# Altium schematic sheet Power.SchDoc
size B; SheetNumber: 3; SheetTotal: 12; SPICEModelCacheUEHXGVAP: <root> / <DocumentId>UEHXGVAP</DocumentId> / </root>
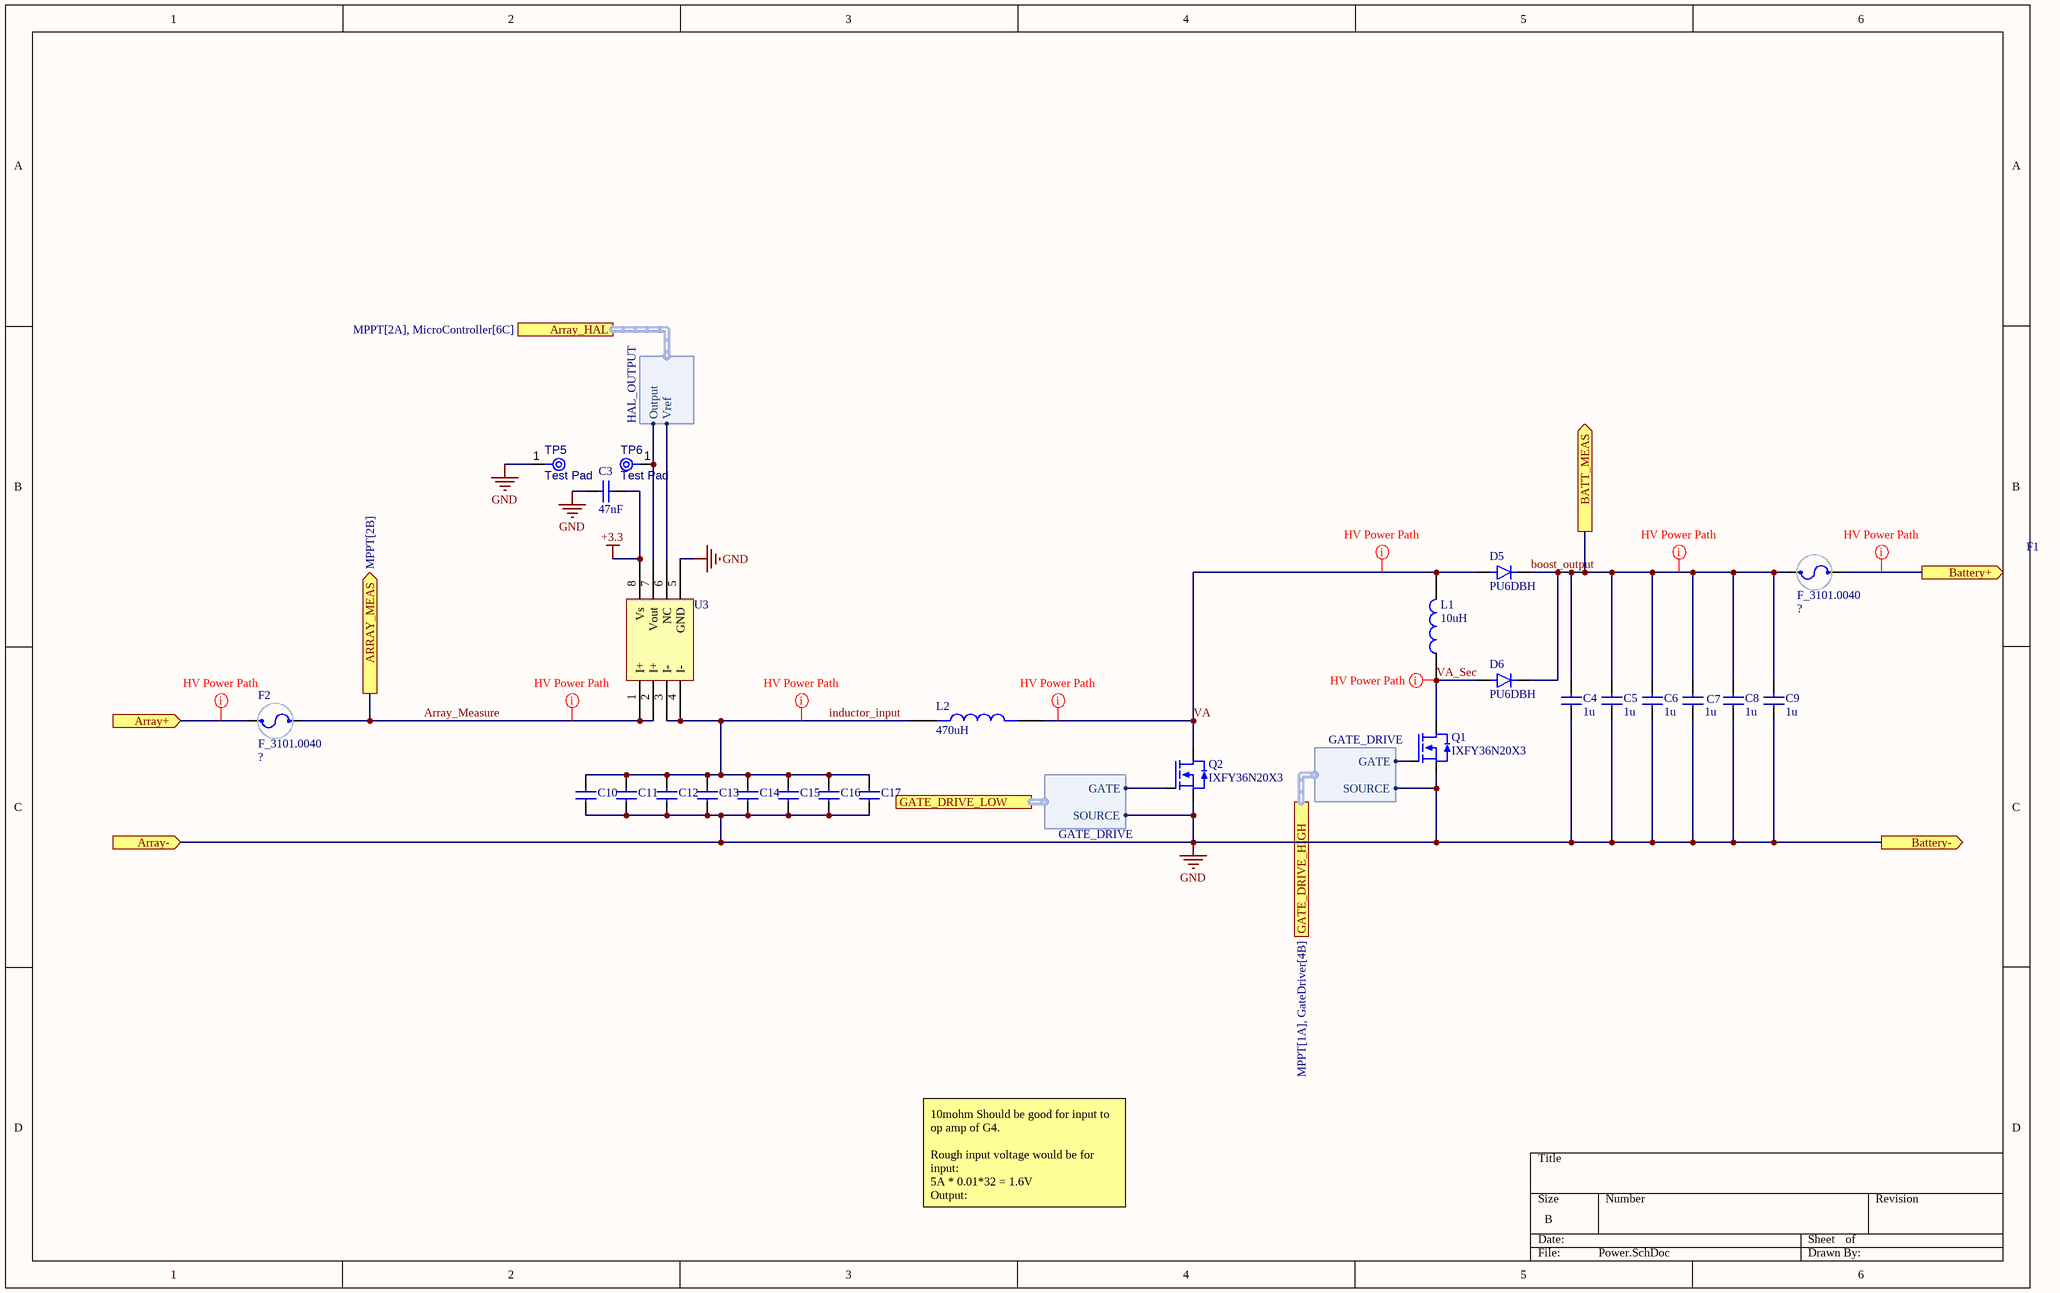
[diagram p0: Power.SchDoc]

## Parts
C3  value 47nF  [0603_CAPACITOR]  (hidden comment: C0603C473K4RECAUTO)
C4  value 1u  [1812_Capacitor]  (hidden comment: KGM43JR72D105JV)
C5  value 1u  [1812_Capacitor]  (hidden comment: KGM43JR72D105JV)
C6  value 1u  [1812_Capacitor]  (hidden comment: KGM43JR72D105JV)
C7  value 1u  [1812_Capacitor]  (hidden comment: KGM43JR72D105JV)
C8  value 1u  [1812_Capacitor]  (hidden comment: KGM43JR72D105JV)
C9  value 1u  [1812_Capacitor]  (hidden comment: KGM43JR72D105JV)
C10  HMK432BJ105MM-T  [1812_Capacitor]  (value not drawn)
C11  HMK432BJ105MM-T  [1812_Capacitor]  (value not drawn)
C12  HMK432BJ105MM-T  [1812_Capacitor]  (value not drawn)
C13  HMK432BJ105MM-T  [1812_Capacitor]  (value not drawn)
C14  HMK432BJ105MM-T  [1812_Capacitor]  (value not drawn)
C15  HMK432BJ105MM-T  [1812_Capacitor]  (value not drawn)
C16  HMK432BJ105MM-T  [1812_Capacitor]  (value not drawn)
C17  HMK432BJ105MM-T  [1812_Capacitor]  (value not drawn)
D5  PU6DBH  [DIOM4336X265N]
D6  PU6DBH  [DIOM4336X265N]
F1  F_3101.0040  [F_FPG4]
F2  F_3101.0040  [F_FPG4]
L1  value 10uH  [INDM125125X600N]  (hidden comment: DR125-100-R)
L2  value 470uH  [ATCA-08-471M-H-Footprint-1]  (hidden comment: ATCA-08-471M-H)
Q1  IXFY36N20X3  [DPAK]
Q2  IXFY36N20X3  [DPAK]
TP5  Test Pad  [Test Pad-Footprint-1]  (no BOM)
TP6  Test Pad  [Test Pad-Footprint-1]  (no BOM)
U3  TMCS1101A2UQDRQ1  [SOIC127P610X173-8N]  (value not drawn)

## Ports
Array+ (in, see MPPT[1B]), Array- (in, see MPPT[1B]), Array_HAL (harness HAL_OUTPUT, see MPPT[2A], MicroController[6C]), ARRAY_MEAS (out, see MPPT[2B]), BATT_MEAS (out, see MPPT[2B]), Battery+ (out, see MPPT[2B]), Battery- (out, see MPPT[2B]), GATE_DRIVE_HIGH (harness GATE_DRIVE, see MPPT[1A], GateDriver[4B]), GATE_DRIVE_LOW (harness GATE_DRIVE, see MPPT[1A], GateDriver[4C])

## Harnesses
GATE_DRIVE: GATE, SOURCE
HAL_OUTPUT: Vref, Output

## Nets
+3.3: C3.2 U3.8(Vs)
GND: C3.1 C4.2 C5.2 C6.2 C7.2 C8.2 C9.2 C10.2 C11.2 C12.2 C13.2 C14.2 C15.2 C16.2 C17.2 Q1.3(SOURCE) Q2.3(SOURCE) TP5.1(TP) U3.5(GND) ; port Array-, port Battery-, port GATE_DRIVE_HIGH.SOURCE, port GATE_DRIVE_LOW.SOURCE
Array+: F2.1 ; port Array+
Array_Measure: F2.2 U3.1(I+) U3.2(I+) ; port ARRAY_MEAS
Battery+: F1.2 ; port Battery+
boost_output: C4.1 C5.1 C6.1 C7.1 C8.1 C9.1 D5.C(K) D6.C(K) F1.1 ; port BATT_MEAS
inductor_input: C10.1 C11.1 C12.1 C13.1 C14.1 C15.1 C16.1 C17.1 L2.1 U3.3(I-) U3.4(I-)
VA: D5.A L1.2 L2.2 Q2.2(DRAIN)
VA_Sec: D6.A L1.1 Q1.2(DRAIN)
NetQ1_1: Q1.1(GATE) ; port GATE_DRIVE_HIGH.GATE
NetQ2_1: Q2.1(GATE) ; port GATE_DRIVE_LOW.GATE
NetTP6_1: TP6.1(TP) U3.7(Vout) ; port Array_HAL.Output
NetU3_6: U3.6(NC) ; port Array_HAL.Vref

## Layout directives
net class High Current; net class HV: Array+, Array_Measure, Battery+, boost_output, inductor_input, VA, VA_Sec

## Notes on the sheet
- 10mohm Should be good for input to op amp of G4.
  Rough input voltage would be for input:
  5A * 0.01*32 = 1.6V
  Output:
  2A * 0.01*64 = 1.28

## Library data of the parts
C3 = CMP-001-00133-1: Ceramic Capacitor, Multilayer, Ceramic, 16V, 10% +Tol, 10% -Tol, X7R, 15% TC, 0.047uF, Surface Mount, 0603; Mounting Technology: SMD; Tolerance: 10%; Capacitor Type: Ceramic; Case/Package: 0603; Voltage Rating: 16V
C4-C9 = CMP-001-00138-1: Cap Cer 1UF 200V X7R 1812; Voltage Rating: 200V
C10-C17 = CMP-001-00139-1: Medium-High Voltage Multilayer Ceramic Capacitors, 100V, 1 uF, ± 20 %, 1812, X5R/B, RoHS; RoHS Compliant: Yes
D5 D6 = CMP-201-000000-3: 25ns, 6A, 200V, Ultra Fast Recovery Rectifier; MF: Taiwan Semiconductor; Component Type: Standard; Digi-Key_Part_Number: 1801-PU6DBHTR-ND; Package: SMD-2 Taiwan Semiconductor; Design Item ID: PU6DBH; Pin Count: 2; MP: PU6DBH
F1 F2 = CMP-047-000004-2: Fuse Holder 16A 500V 1 Circuit Cartridge PCB; Manufacturer: Schurter; Voltage Rating (AC): 400V; Power Dissipation: 2.5W; Body Material: Thermoplastic; Voltage Rating (DC): 250V; Approvals: UL,CSA,VDE,IEC,SEMKO; Value: ?; Max Current: 16A; Manufacturer Part Number: 3101.0040; Min Operating Temperature: -40°C; Source: misc.SchLib; Design Item ID: F_3101.0040; Max Operating Temperature: 85°C
L1 = CMP-006-00027-1: Ind Power Shielded Wirewound 10uH 20% 100KHz Ferrite 5.35A T/R; DC Resistance (DCR): 18.9mR; Max DC Current: 7.17A; Inductor Type: POWER INDUCTOR; Mounting Technology: Surface Mount; Width: 0.492inch; Max Current Rating: 5.35A; Length: 12.5mm; Termination: SMD/SMT; Core Material: Ferrite; Weight: 0.144oz; Series: DR; DC Current: 5.35A; Tolerance: 20%; Test Frequency: 100kHz; Case/Package: Nonstandard; Depth: 12.5mm; RMS Current (Irms): 5.35A; Package Quantity: 600; Current Rating: 5.35A; Packaging: Tape and Reel; Saturation Current: 7.17A; Inductance Tolerance: 20%; Military Standard: Not; Height - Seated (Max): 0.236inch; Self Resonant Frequency: 100kHz; Height: 6mm; RoHS Compliant: Yes; Max Operating Temperature: 125°C; Shielding: Shielded; Min Operating Temperature: -40°C; Pins: 2; Reach SVHC Compliant: No; Radiation Hardening: No
L2 = CMP-006-00025-8: Coustom wound inductor using 79617A7 core; Tolerance: 20%; Max Current Rating: 11A; Min Operating Temperature: 105°C; Max Operating Temperature: -40°C; Pins: 2; Mounting Technology: TH; RoHS Compliant: Yes; Case/Package: torodial; Current Rating: 11A
Q1 Q2 = CMP-013-00046-1: X3-Class Series - 150V - 300V N-Channel Ultra Junction Power MOSFETs with HiPerFET™ Options, TO-252, RoHS; Input Capacitance: 1.425nF; Power: 176W; Rds On Max: 45mR; Drain to Source Voltage (Vdss): 200V; Continuous Drain Current (ID): 36A; Series: HiPerFET™; Packaging: Rail/Tube; Case/Package: TO-252AA; Max Operating Temperature: 150°C; Mounting Technology: Surface Mount; Min Operating Temperature: -55°C; RoHS Compliant: No
TP5 TP6 = CMP-00039-1: A circular test pad for soldering a wire to or spring tip if necessary
U3 = CMP-010-00029-1: Automotive, precision isolated current sensor with internal reference 8-SOIC -40 to 125; Max Supply Voltage: 5.5V; Min Supply Voltage: 3; Sensor Type: Hall; Nominal Supply Current: 26mA; Nominal Supply Voltage: 3.3V; Max Operating Temperature: 125°C; Min Operating Temperature: -40°C; Pins: 8; Case/Package: 8-SOIC; Mounting Technology: SMD; RoHS Compliant: Yes